# EAGLE design Öffnungsmelder (EAGLE 4.15)
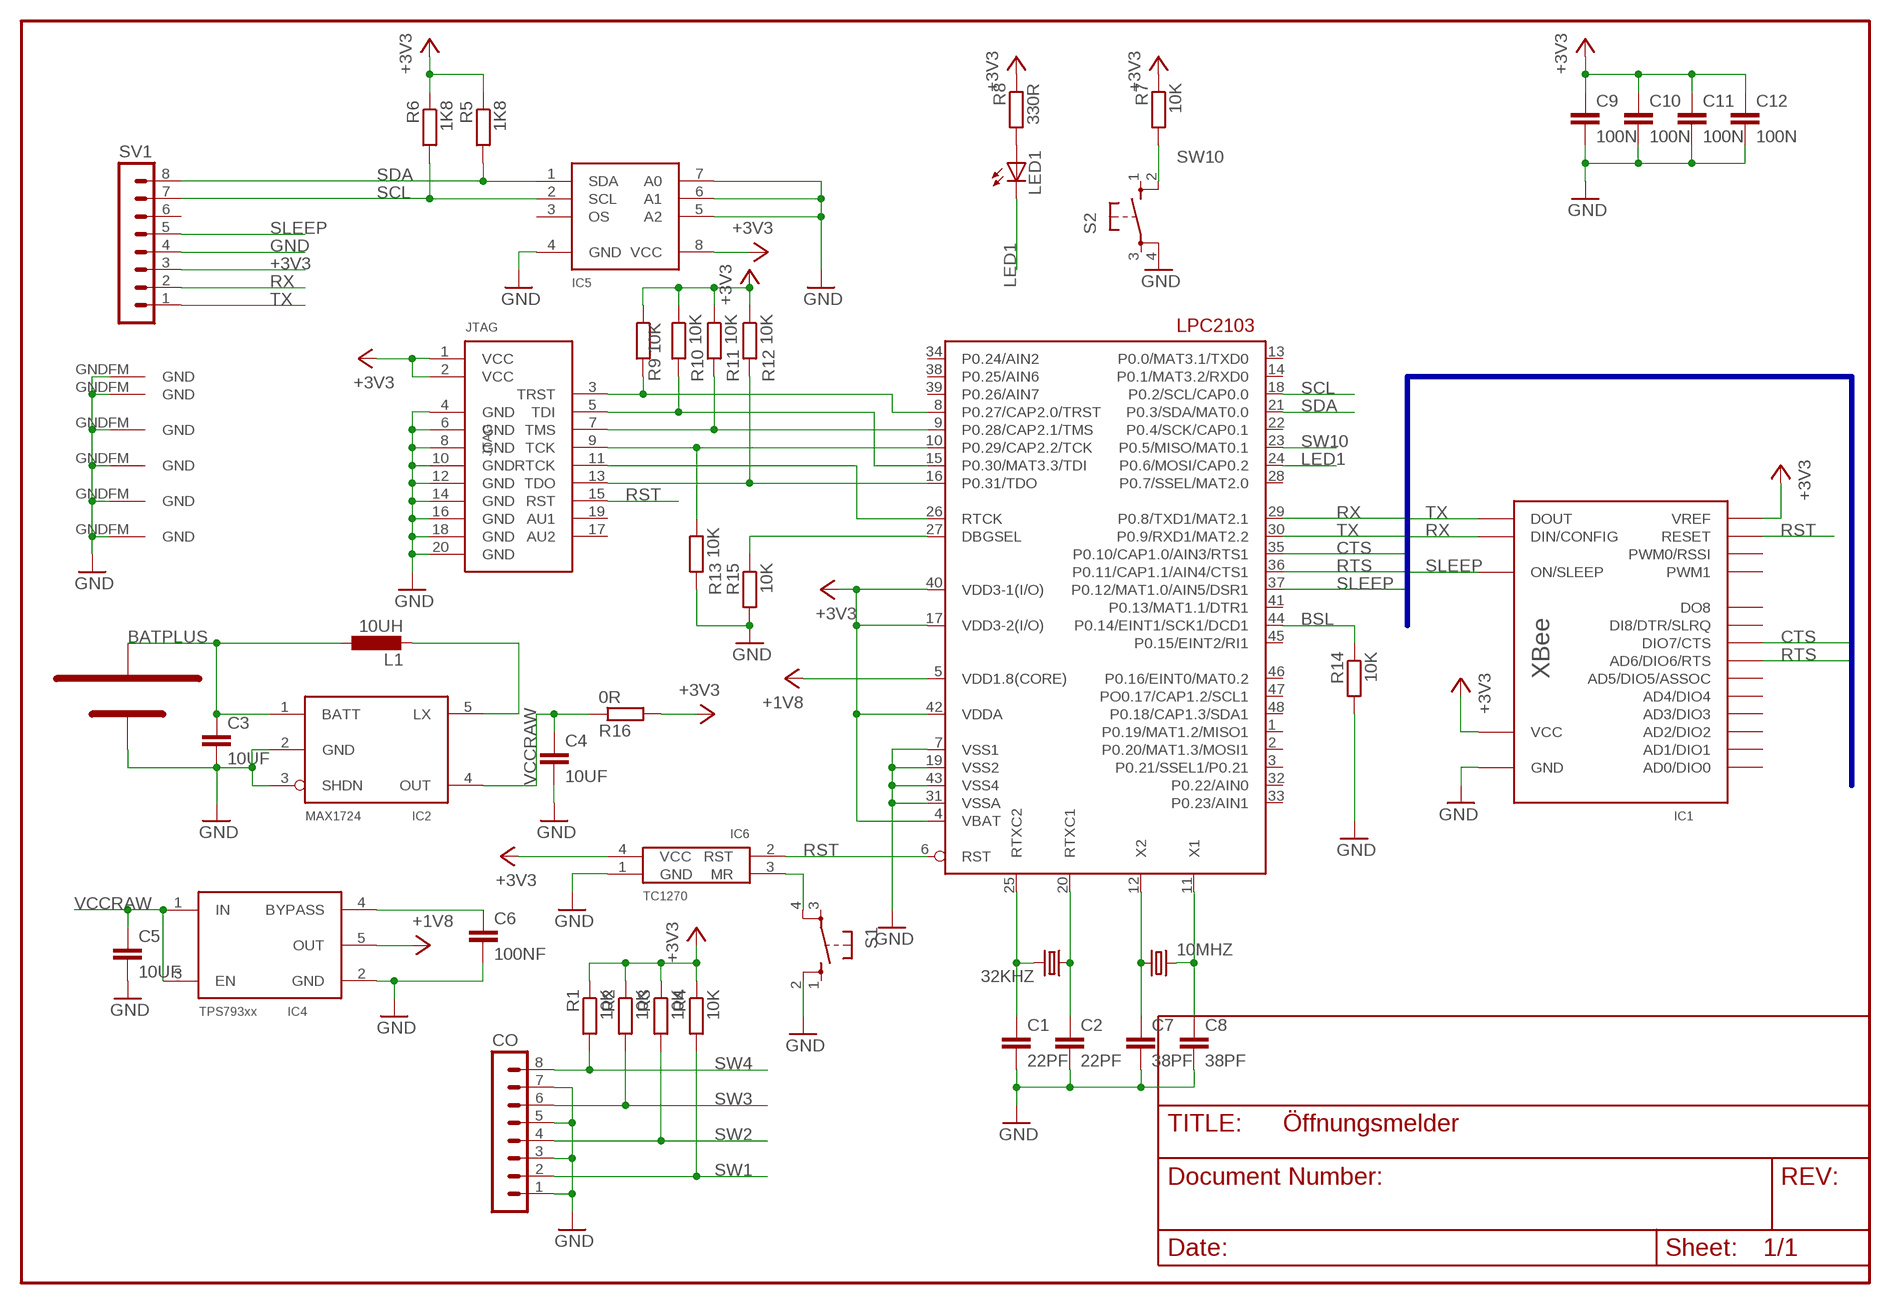
[diagram p0: schematic, sheet 1]

## Parts
10MHZ  CRYTALHC49S  [HC49/S]
32KHZ  CRYTALTC26V  [TC26V]
C1  22PF  C-EUC0805  [C0805]
C2  22PF  C-EUC0805  [C0805]
C3  10UF  C-EUC0805  [C0805]
C4  10UF  C-EUC0805  [C0805]
C5  10UF  C-EUC0805  [C0805]
C6  100NF  C-EUC0805  [C0805]
C7  38PF  C-EUC0805  [C0805]
C8  38PF  C-EUC0805  [C0805]
C9  100N  C-EUC0805  [C0805]
C10  100N  C-EUC0805  [C0805]
C11  100N  C-EUC0805  [C0805]
C12  100N  C-EUC0805  [C0805]
CO  MA08-1  [MA08-1]
GND  STITCHVIA  [STITCHVIA]
GND19  STITCHVIA  [STITCHVIA]
IC1  XBEE  [XBEE]
IC2  MAX1724  [SOT23-5L]
IC3  LPC2103  [LQFP48]
IC4  TPS793XX  [SOT23-5L]
IC5  SE95  [MSOP8]
IC6  TC1270  [SOT143R_INFINEON]
JTAG  ARM-JTAGVERTIKAL  [ML20]
L1  10UH  L-EU  [L2634MURATA]
LED1  LEDCHIP-LED0805  [CHIP-LED0805]
R1  10K  R-EU_M0805  [M0805]
R2  10K  R-EU_M0805  [M0805]
R3  10K  R-EU_M0805  [M0805]
R4  10K  R-EU_M0805  [M0805]
R5  1K8  R-EU_M0805  [M0805]
R6  1K8  R-EU_M0805  [M0805]
R7  10K  R-EU_M0805  [M0805]
R8  330R  R-EU_M0805  [M0805]
R9  10K  R-EU_M0805  [M0805]
R10  10K  R-EU_M0805  [M0805]
R11  10K  R-EU_M0805  [M0805]
R12  10K  R-EU_M0805  [M0805]
R13  10K  R-EU_M0805  [M0805]
R14  10K  R-EU_M0805  [M0805]
R15  10K  R-EU_M0805  [M0805]
R16  0R  R-EU_M0805  [M0805]
S1  10XX  [B3F-10XX]
S2  10XX  [B3F-10XX]
SV1  MA08-1  [MA08-1]
U$1  BATTERY_SINGLECELL  [BATTERYHOLDER_AA_SINGLE]
U$3  STITCHVIA  [STITCHVIA]
U$4  STITCHVIA  [STITCHVIA]
U$5  STITCHVIA  [STITCHVIA]
U$6  STITCHVIA  [STITCHVIA]

## Nets
+3V3: C9.1 C10.1 C11.1 C12.1 IC1.1(VCC) IC1.14(VREF) IC3.4(VBAT) IC3.17(VDD3-2(I/O)) IC3.40(VDD3-1(I/O)) IC3.42(VDDA) IC5.8(VCC) IC6.4(VCC) JTAG.1(VCC) JTAG.2(VCC) R1.1 R2.1 R3.1 R4.1 R5.1 R6.1 R7.1 R8.1 R9.1 R10.1 R11.1 R12.1 R16.2 SV1.3
BATPLUS: C3.1 IC2.1(BATT) L1.P$1 U$1.VCC
BSL: IC3.44(P0.14/EINT1/SCK1/DCD1) R14.1
CTS: IC1.12(DIO7/CTS) IC3.35(P0.10/CAP1.0/AIN3/RTS1)
GND: C1.2 C2.2 C3.2 C4.2 C5.2 C6.2 C7.2 C8.2 C9.2 C10.2 C11.2 C12.2 CO.1 CO.3 CO.5 CO.7 GND19.GNDFM(GND) GND.GNDFM(GND) IC1.10(GND) IC2.2(GND) IC2.3(SHDN) IC3.7(VSS1) IC3.19(VSS2) IC3.31(VSSA) IC3.43(VSS4) IC4.2(GND) IC5.4(GND) IC5.5(A2) IC5.6(A1) IC5.7(A0) IC6.1(GND) JTAG.4(GND) JTAG.6(GND) JTAG.8(GND) JTAG.10(GND) JTAG.12(GND) JTAG.14(GND) JTAG.16(GND) JTAG.18(GND) JTAG.20(GND) R13.2 R14.2 R15.2 S1.2 S2.4 SV1.4 U$1.GND U$3.GNDFM(GND) U$4.GNDFM(GND) U$5.GNDFM(GND) U$6.GNDFM(GND)
LED1: IC3.24(P0.6/MOSI/CAP0.2) LED1.C
MANRST: IC6.3(MR) S1.4
N$1: 32KHZ.2 C1.1 IC3.25(RTXC2)
N$2: 32KHZ.1 C2.1 IC3.20(RTXC1)
N$3: 10MHZ.1 C7.1 IC3.12(X2)
N$4: 10MHZ.2 C8.1 IC3.11(X1)
N$6: IC3.26(RTCK) JTAG.11(RTCK)
N$7: IC3.8(P0.27/CAP2.0/TRST) JTAG.3(TRST) R9.2
N$8: IC3.15(P0.30/MAT3.3/TDI) JTAG.5(TDI) R10.2
N$9: IC3.9(P0.28/CAP2.1/TMS) JTAG.7(TMS) R11.2
N$10: IC3.10(P0.29/CAP2.2/TCK) JTAG.9(TCK) R13.1
N$14: LED1.A R8.2
N$15: IC2.5(LX) L1.P$2
N$16: IC3.27(DBGSEL) R15.1
N$17: C6.1 IC4.4(BYPASS)
N$19: IC3.16(P0.31/TDO) JTAG.13(TDO) R12.2
RST: IC1.5(RESET) IC3.6(RST) IC6.2(RST) JTAG.15(RST)
RTS: IC1.16(AD6/DIO6/RTS) IC3.36(P0.11/CAP1.1/AIN4/CTS1)
RX: IC1.3(DIN/CONFIG) IC3.29(P0.8/TXD1/MAT2.1) SV1.2
SCL: IC3.18(P0.2/SCL/CAP0.0) IC5.2(SCL) R6.2 SV1.7
SDA: IC3.21(P0.3/SDA/MAT0.0) IC5.1(SDA) R5.2 SV1.8
SLEEP: IC1.13(ON/SLEEP) IC3.37(P0.12/MAT1.0/AIN5/DSR1) SV1.5
SW1: CO.2 R4.2
SW2: CO.4 R3.2
SW3: CO.6 R2.2
SW4: CO.8 R1.2
SW10: IC3.23(P0.5/MISO/MAT0.1) R7.2 S2.2
TX: IC1.2(DOUT) IC3.30(P0.9/RXD1/MAT2.2) SV1.1
VCCINT: IC3.5(VDD1.8(CORE)) IC4.5(OUT) ; supply symbol labelled +1V8
VCCRAW: C4.1 C5.1 IC2.4(OUT) IC4.1(IN) IC4.3(EN) R16.1
Unconnected: IC1.4(DO8) IC1.6(PWM0/RSSI) IC1.7(PWM1) IC1.9(DI8/DTR/SLRQ) IC1.11(AD4/DIO4) IC1.15(AD5/DIO5/ASSOC) IC1.17(AD3/DIO3) IC1.18(AD2/DIO2) IC1.19(AD1/DIO1) IC1.20(AD0/DIO0) IC3.1(P0.19/MAT1.2/MISO1) IC3.2(P0.20/MAT1.3/MOSI1) IC3.3(P0.21/SSEL1/P0.21) IC3.13(P0.0/MAT3.1/TXD0) IC3.14(P0.1/MAT3.2/RXD0) IC3.22(P0.4/SCK/CAP0.1) IC3.28(P0.7/SSEL/MAT2.0) IC3.32(P0.22/AIN0) IC3.33(P0.23/AIN1) IC3.34(P0.24/AIN2) IC3.38(P0.25/AIN6) IC3.39(P0.26/AIN7) IC3.41(P0.13/MAT1.1/DTR1) IC3.45(P0.15/EINT2/RI1) IC3.46(P0.16/EINT0/MAT0.2) IC3.47(PO0.17/CAP1.2/SCL1) IC3.48(P0.18/CAP1.3/SDA1) IC5.3(OS) JTAG.17(AU2) JTAG.19(AU1) S1.1 S1.3 S2.1 S2.3 SV1.6

## Buses
SLEEP,RX,TX,CTS,RTS

## Library data of the parts
10MHZ 32KHZ = turbod3:CRYTAL: CRYSTAL
C1-C12 = turbod3:C-EU: CAPACITOR, European symbol
CO SV1 = con-lstb:MA08-1: PIN HEADER
GND GND19 U$3-U$6 = turbod3:STITCHVIA
IC1 = turbod3:XBEE
IC2 = turbod3:MAX1724
IC3 = turbod3:LPC2103: LPC2101/2102/2103 microcontroler from Philips
IC4 = turbod3:TPS793XX
IC5 = turbod3:SE95
IC6 = turbod3:TC1270
JTAG = turbod3:ARM-JTAG
L1 = turbod3:L-EU: INDUCTOR, European symbol
LED1 = led:LED: LED OSRAM: - CHIPLED LG R971, LG N971, LY N971, LG Q971, LY Q971, LO R971, LY R971 LH N974, LH R974 LS Q976, LO Q976, LY Q976 LO Q996 - Hyper CHIPLED LW Q18S LB Q993, LB Q99A, LB R99A - SideLED LS A670, LO A670, LY A670, LG A670, LP A670 LB A673, LV A673, LT A673, LW A673 LH A674 LY A675 LS A676, LA A676, LO A676, LY A676, LW A676 LS A679, LY A679, LG A679 - Hyper Micro SIDELED® LS Y876, LA Y876, LO Y876, LY Y876 LT Y87S - SmartLED LW L88C, LW L88S LB L89C, LB L89S, LG L890 LS L89K, LO L89K, LY L89K LS L896, LA L896, LO L896, LY L896 - TOPLED LS T670, LO T670, LY T670, LG T670, LP T670 LSG T670, LSP T670, LSY T670, LOP T670, LYG T670 LG T671, LOG T671, LSG T671 LB T673, LV T673, LT T673, LW T673 LH T674 LS T676, LA T676, LO T676, LY T676, LB T676, LH T676, LSB T676, LW T676 LB T67C, LV T67C, LT T67C, LS T67K, LO T67K, LY T67K, LW E67C LS E67B, LA E67B, LO E67B, LY E67B, LB E67C, LV E67C, LT E67C LW T67C LS T679, LY T679, LG T679 LS T770, LO T770, LY T770, LG T770, LP T770 LB T773, LV T773, LT T773, LW T773 LH T774 LS E675, LA E675, LY E675, LS T675 LS T776, LA T776, LO T776, LY T776, LB T776 LHGB T686 LT T68C, LB T68C - Hyper Mini TOPLED® LB M676 - Mini TOPLED Santana® LG M470 LS M47K, LO M47K, LY M47K Source: http://www.osram.convergy.de/
R1-R16 = turbod3:R-EU_: RESISTOR, European symbol
S1 S2 = KEY_B:10XX
U$1 = turbod3:BATTERY_SINGLECELL

## Board
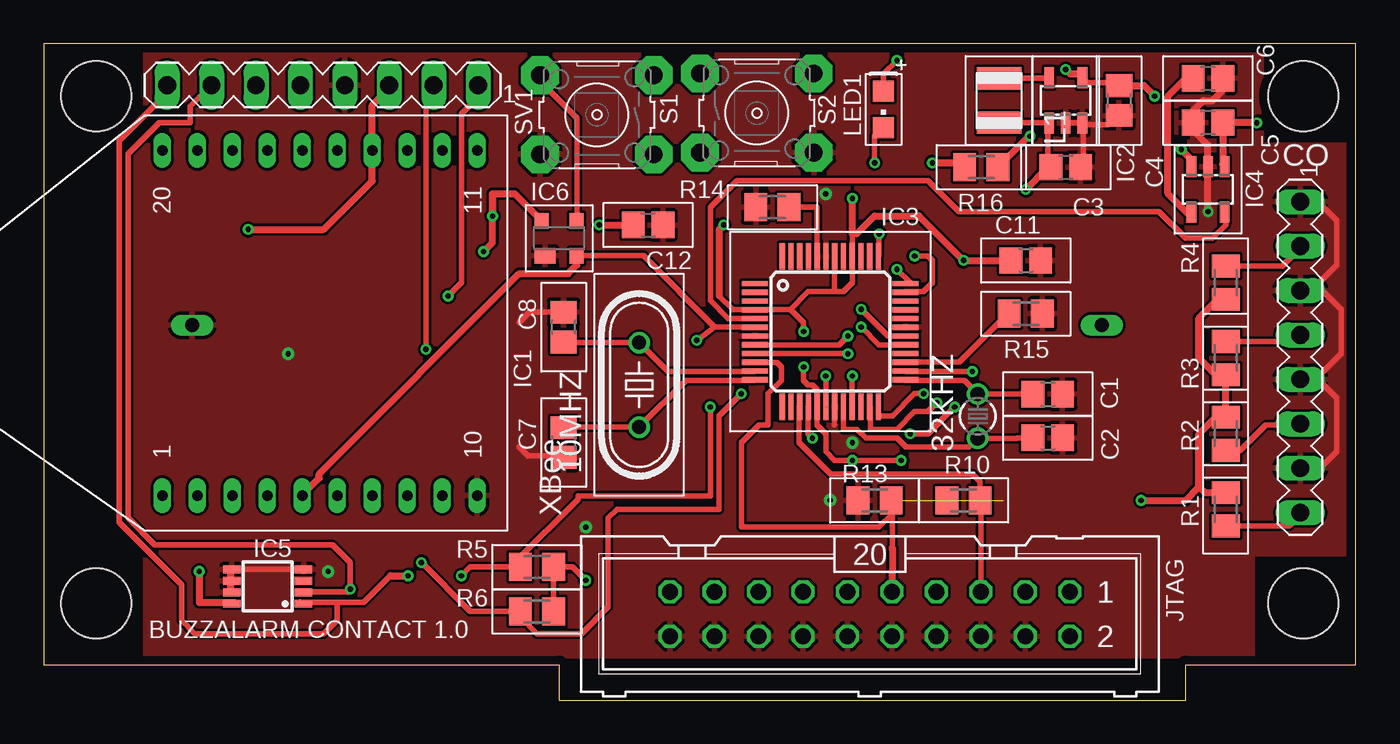
[diagram p1: board, top side]
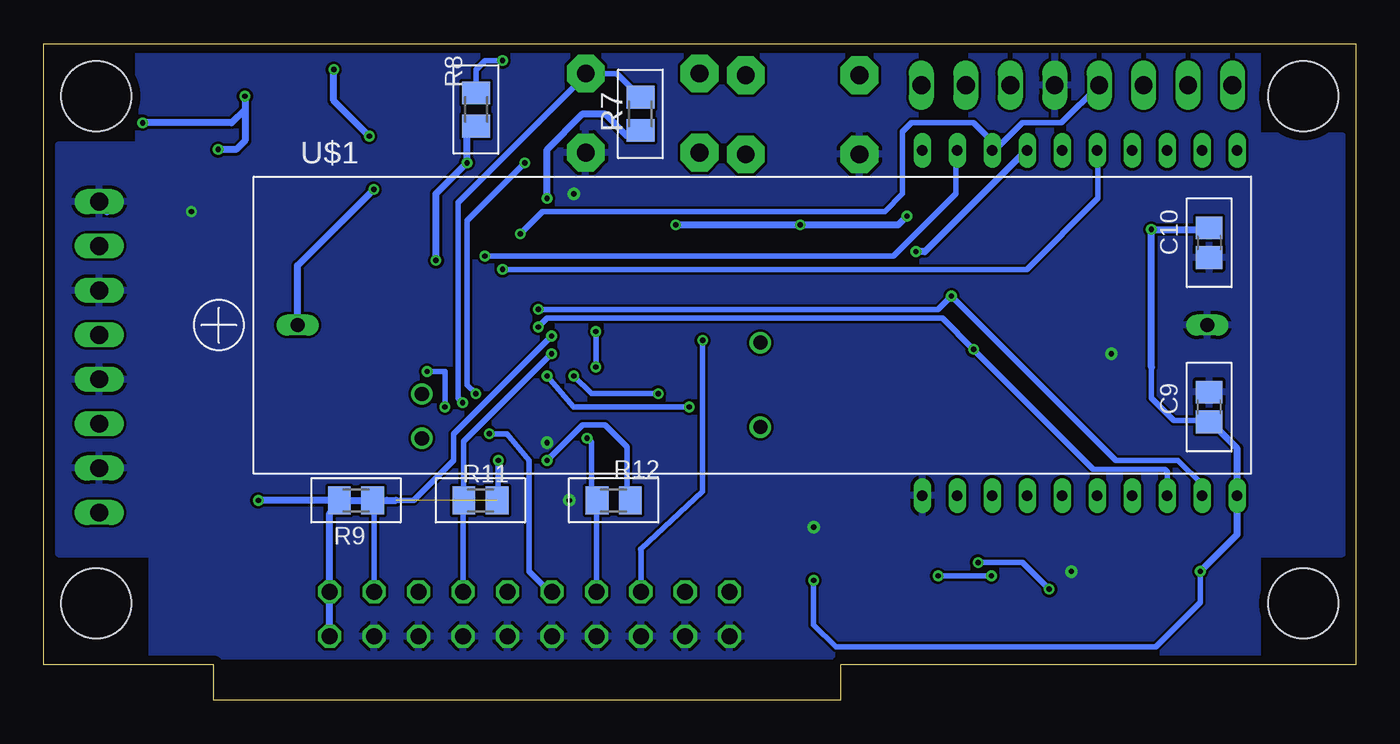
[diagram p2: board, bottom side, seen from below]

Size 75 x 37.54 mm. Coordinates in mm from the lower left corner, seen from the top.
Outline: 0,2.03 29.46,2.03 29.46,0 65.28,0 65.28,2.03 75,2.03 75,37.54 0,37.54 0,2.03
Copper layers (1*16): Top 0.035mm / dielectric 1.5mm / Bottom 0.035mm
Design rules "PCB-POOL": minimum track width 6mil, minimum drill 12mil, track to track 6mil, track to pad 6mil, pad to pad 6mil, via to via 6mil, smd to smd 6mil, copper to edge 20mil, drill to drill 8mil, minimum pad ring 8mil, minimum via ring 6mil, stop-mask expansion 3mil, vias tented up to drill 0mil, thermal gap 8mil
Holes 4 mm at 3,34.54 3,5.54 72,34.54 72,5.54

### Footprints (pad centres in the part's own frame; a part is rotated, then mirrored left to right if it is on the bottom)
HC49/S = drill 0.813 round: 1 -2.413,0; 2 2.413,0
TC26V = drill 0.813 round: 1 -1.27,0; 2 1.27,0
C0805 = smd 1.3 x 1.5: 1 -0.85,0; 2 0.85,0
MA08-1 = drill 1.016 long: 1 -8.89,0; 2 -6.35,0; 3 -3.81,0; 4 -1.27,0; 5 1.27,0; 6 3.81,0; 7 6.35,0; 8 8.89,0
STITCHVIA = drill 0.305 pad 0.61 round: GNDFM 0,0
XBEE = drill 0.6 long: 1 -9.73,17; 2 -9.73,15; 3 -9.73,13; 4 -9.73,11; 5 -9.73,9; 6 -9.73,7; 7 -9.73,5; 8 -9.73,3; 9 -9.73,1; 10 -9.73,-1; 11 10,-1; 12 10,1; 13 10,3; 14 10,5; 15 10,7; 16 10,9; 17 10,11; 18 10,13; 19 10,15; 20 10,17
SOT23-5L = smd 0.55 x 1.2: 1 -0.95,-1.3; 2 0,-1.3; 3 0.95,-1.3; 4 0.95,1.3; 5 -0.95,1.3
LQFP48 = smd 1.5 x 0.3: 1 -4.3,2.75; 2 -4.3,2.25; 3 -4.3,1.75; 4 -4.3,1.25; 5 -4.3,0.75; 6 -4.3,0.25; 7 -4.3,-0.25; 8 -4.3,-0.75; 9 -4.3,-1.25; 10 -4.3,-1.75; 11 -4.3,-2.25; 12 -4.3,-2.75; 25 4.3,-2.75; 26 4.3,-2.25; 27 4.3,-1.75; 28 4.3,-1.25; 29 4.3,-0.75; 30 4.3,-0.25; 31 4.3,0.25; 32 4.3,0.75; 33 4.3,1.25; 34 4.3,1.75; 35 4.3,2.25; 36 4.3,2.75 | smd 0.3 x 1.5: 13 -2.75,-4.3; 14 -2.25,-4.3; 15 -1.75,-4.3; 16 -1.25,-4.3; 17 -0.75,-4.3; 18 -0.25,-4.3; 19 0.25,-4.3; 20 0.75,-4.3; 21 1.25,-4.3; 22 1.75,-4.3; 23 2.25,-4.3; 24 2.75,-4.3; 37 2.75,4.3; 38 2.25,4.3; 39 1.75,4.3; 40 1.25,4.3; 41 0.75,4.3; 42 0.25,4.3; 43 -0.25,4.3; 44 -0.75,4.3; 45 -1.25,4.3; 46 -1.75,4.3; 47 -2.25,4.3; 48 -2.75,4.3
MSOP8 = smd 0.45 x 1: 1 -0.975,-2.05; 2 -0.325,-2.05; 3 0.325,-2.05; 4 0.975,-2.05; 5 0.975,2.05; 6 0.325,2.05; 7 -0.325,2.05; 8 -0.975,2.05
SOT143R_INFINEON = smd 1.2 x 0.9: 1 -0.8,-1 | smd 0.8 x 0.9: 2 1,-1; 3 1,1; 4 -1,1
ML20 = drill 0.914 octagon: 1 -11.43,-1.27; 2 -11.43,1.27; 3 -8.89,-1.27; 4 -8.89,1.27; 5 -6.35,-1.27; 6 -6.35,1.27; 7 -3.81,-1.27; 8 -3.81,1.27; 9 -1.27,-1.27; 10 -1.27,1.27; 11 1.27,-1.27; 12 1.27,1.27; 13 3.81,-1.27; 14 3.81,1.27; 15 6.35,-1.27; 16 6.35,1.27; 17 8.89,-1.27; 18 8.89,1.27; 19 11.43,-1.27; 20 11.43,1.27
L2634MURATA = smd 1.27 x 2.54: P$1 -1.27,0; P$2 1.27,0
CHIP-LED0805 = smd 1.2 x 1.2: A 0,-1.05; C 0,1.05
M0805 = smd 1.3 x 1.6: 1 -0.95,0; 2 0.95,0
B3F-10XX = drill 1.016 pad 2.159 octagon: 1 -3.379,2.312; 2 3.123,2.312; 3 -3.379,-2.209; 4 3.123,-2.209
BATTERYHOLDER_AA_SINGLE = drill 0.8 pad 1 long: GND -26.5,0.5; VCC 25.5,0.5

### Placement (x,y rotation side)
10MHZ  34.04,18.03 90 top
32KHZ  53.39,16.24 90 top
C1  57.39,17.5 0 top
C2  57.39,15.01 0 top
C3  58.42,30.48 0 top
C4  61.47,34.29 270 top
C5  66.55,33.02 180 top
C6  66.55,35.56 0 top
C7  29.72,14.73 270 top
C8  29.72,21.34 90 top
C9  8.38,16.76 90 bottom
C10  8.38,26.16 270 bottom
C11  56.13,25.15 0 top
C12  34.54,27.18 0 top
CO  71.83,19.62 270 top
GND  44.96,11.43 0 top
GND19  46.23,14.73 0 top
IC1  23.77,21.44 90 top
IC2  58.42,34.29 0 top
IC3  44.96,21.08 0 top
IC4  66.55,29.21 180 top
IC5  12.8,6.5 90 top
IC6  29.46,26.42 0 top
JTAG  47.22,4.93 180 top
L1  54.61,34.29 90 top
LED1  48.01,33.78 180 top
R1  67.56,10.92 270 top
R2  67.56,15.24 270 top
R3  67.56,19.56 90 top
R4  67.56,23.88 90 top
R5  28.19,7.62 180 top
R6  28.19,5.08 180 top
R7  40.89,33.53 90 bottom
R8  50.29,33.78 90 bottom
R9  57.15,11.43 0 bottom
R10  52.58,11.43 0 top
R11  50.04,11.43 180 bottom
R12  42.42,11.43 180 bottom
R13  47.5,11.43 180 top
R14  41.66,28.19 180 top
R15  56.13,22.1 0 top
R16  53.59,30.48 180 top
S1  31.5,33.53 180 top
S2  40.89,33.53 0 top
SV1  15.94,35.17 180 top
U$1  34.99,21.95 180 bottom
U$3  13.97,19.81 0 top
U$4  44.7,28.96 0 top
U$5  30.99,9.91 0 top
U$6  16.26,7.37 0 top

### Tracks (layer width: path | path; a pad name or v marks a point on that pad's centre or on a via)
+3V3  (via drill 0.3)  (2 unrouted)
  Top 0.305: 42.67,22.35 43.69,23.37 45.21,23.37 | IC3.42 45.21,25.4 | IC3.42 | IC3.42 | 45.21,23.37 IC3.42 | 45.21,23.37 45.72,23.37 46.23,23.88 46.23,25.4 | IC3.40 46.23,25.4 | 42.67,22.35 40.68,22.35 IC3.4 39.39,22.33 38.61,23.11 | 42.67,22.35 43.43,21.59 v43.43,21.08 | 44.2,16.79 IC3.17 44.2,16.77 | v43.43,19.05 43.43,18.29 43.69,18.03 43.94,18.03 44.2,17.78 44.2,16.77 | 44.2,16.77 44.2,16.76 | 44.2,16.77 44.2,15.75 44.7,15.24 44.7,14.22 45.21,13.72 v46.23,13.72 v49.02,13.72 | 46.23,25.4 46.23,26.67 46.48,26.67 | R6.1 29.21,5.33 29.14,5.4 R5.1 30.23,7.62 v30.99,6.86
  Top 0.406: R4.1 67.12,22.93 66.04,21.84 66.04,19.56 67.31,18.29 67.56,18.54 R3.1 R2.1 67.56,16.26 67.31,16.51 66.04,15.24 66.04,12.19 | R1.1 66.36,11.87 66.04,12.19 | 46.48,26.67 47.5,27.69 50.04,27.69 v52.58,25.15 C11.1 55.37,25.15 | v62.74,11.43 65.28,11.43 66.04,12.19 | R16.2 52.58,30.48 52.32,30.73 v50.8,30.73 | 46.23,26.67 v46.23,28.7 | 38.61,23.11 38.61,26.92 v38.86,27.18 | 25.65,28.96 v25.65,27.69 | 25.65,28.96 26.92,28.96 IC6.4 | v31.75,27.18 C12.1 | SV1.3 19.75,35.11 19.81,35.05 18.77,34.01 18.77,31.47 | 18.77,31.47 IC1.14 | 25.65,28.96 25.65,26.16 v25.15,25.65 | 18.77,31.47 18.77,29.7 16,26.92 v11.68,26.92 | v8.89,7.37 8.89,5.59 10.92,5.59 10.86,5.53 IC5.8
  Bottom 0.305: v43.43,21.08 v43.43,19.05 | v46.23,13.72 44.2,15.75 42.93,15.75 41.66,14.48 41.66,11.43 R12.1 | R11.1 49.02,11.43 v49.02,13.72 | v30.99,6.86 30.99,4.32 29.72,3.05 11.43,3.05 8.89,5.59 v8.89,7.37 | 11.68,19.05 11.68,17.27 10.41,16 8.38,16
  Bottom 0.406: JTAG.2 58.65,6.07 58.67,6.1 58.65,6.12 JTAG.1 58.65,10.69 57.91,11.43 | 57.91,11.43 R9.1 v62.74,11.43 | v52.58,25.15 52.58,28.96 v50.8,30.73 50.8,32.51 50.29,33.02 R8.1 | v46.23,28.7 46.23,31.5 44.2,33.53 42.93,33.53 41.66,32.26 41.15,32.26 40.89,32.51 R7.1 | v25.65,27.69 26.16,27.18 v31.75,27.18 v38.86,27.18 | IC1.14 18.77,31.47 18.8,31.5 24.64,25.65 v25.15,25.65 | C10.1 8.38,26.92 v11.68,26.92 11.68,19.05 | 8.55,15.91 C9.1 8.38,16 6.77,14.39 IC1.1 6.77,9.48 v8.89,7.37 | 57.91,11.43 55.37,11.43 54.86,11.43
BATPLUS  (via drill 0.3)
  Top 0.305: L1.P$1 57.44,33.02 IC2.1 57.4,32.92 57.4,30.48
  Top 0.406: C3.1 57.4,30.48 v56.13,29.21
  Bottom 0.406: U$1.VCC 60.49,24.86 v56.13,29.21
BSL
  Top 0.305: IC3.44 44.2,25.39 44.2,28.19 R14.1
CTS  (via drill 0.3)
  Top 0.305: v49.78,25.4 50.55,25.4 50.8,25.15 50.8,23.88 50.29,23.37 49.28,23.37 49.28,23.35 IC3.35
  Bottom 0.305: IC1.12 22.86,31.35 22.86,28.96 26.42,25.4 v49.78,25.4
GND  (via drill 0.3)
  Top 0.305: C3.2 59.44,30.48 59.44,32.92 | 59.44,32.92 IC2.3 59.34,33.02 58.42,33.02 IC2.2 | IC5.5 14.94,7.48 | C8.2 27.77,22.19 27.18,21.59 | 27.18,14.48 27.69,13.97 29.72,13.97 C7.2 | CO.7 72.96,13.27 73.91,14.22 73.91,17.27 72.77,18.41 | 72.77,18.41 72.39,18.8 71.88,18.29 CO.5 | 72.39,23.43 73.09,23.43 74.17,22.35 74.17,19.81 72.77,18.41 | 72.39,23.43 CO.3 | 72.77,18.41 72.64,18.29 | CO.1 72.84,28.51 73.91,27.43 73.91,24.89 72.39,23.37 72.39,23.43 | C4.2 61.47,33.53 60.86,32.92 59.44,32.92 | IC3.19 45.21,15.75
  Top 0.406: 10.67,6.83 10.67,6.81 | IC5.5 10.67,7.48 10.67,6.83 | IC5.7 10.67,6.18 10.67,6.83 | 10.67,6.83 IC5.6 | C6.2 67.4,34.89 66.8,34.29 66.29,34.29 65.53,33.53 65.53,33.02 C5.2 65.7,32.6 66.55,31.75 IC4.2 | IC4.2 66.55,30.48 | v66.55,27.94 IC4.2 | IC5.4 14.88,7.48 14.94,7.42 14.94,7.48 IC5.4
  Bottom 0.406: CO.1 71.88,28.45 71.37,27.94
  pour Top: 0.51,31.75 5.84,31.75 5.84,37.08 69.6,37.08 69.6,31.75 74.68,31.75 74.93,8.38 69.09,8.38 69.09,2.54 5.84,2.54 5.84,8.38 0.51,8.38
  pour Bottom: 0.76,8.38 0.76,32.26 5.59,32.26 5.59,37.08 69.6,37.08 69.6,32 69.6,31.75 74.17,31.75 74.17,8.38 68.83,8.38 68.83,2.54 5.59,2.54 5.59,8.38 6.35,8.38
LED1  (via drill 0.3)
  Top 0.305: IC3.24 47.73,16.26 48.51,16.26 49.78,17.53 v50.29,17.53 | LED1.C 48.01,32.77 47.5,32.26 v47.5,30.73
  Bottom 0.305: v50.29,17.53 50.8,18.03 50.8,27.43 v47.5,30.73
MANRST
  Top 0.305: IC6.3 30.48,27.43 30.48,33.27 28.45,35.31 28.45,35.81 | 28.45,35.81 | 28.45,35.81 S1.4
N$1
  Top 0.305: IC3.25 49.28,18.31 49.28,18.29 52.62,18.29 32KHZ.2 55.87,17.51 | 55.87,17.51 55.85,17.5 C1.1 | 55.87,17.51 55.88,17.53
N$2
  Top 0.305: IC3.20 45.72,15.49 46.48,15.49 46.99,14.99 48.77,14.99 49.28,14.48 52.9,14.48 32KHZ.1 55.61,14.97 55.65,15.01 C2.1
N$3
  Top 0.305: IC3.12 40.64,18.31 40.64,18.29 36.7,18.29 10MHZ.1 29.84,15.62 29.72,15.75 C7.1
N$4
  Top 0.305: IC3.11 40.64,18.81 40.64,18.8 35.69,18.8 10MHZ.2 29.59,20.45 29.55,20.49 | 29.55,20.49 29.46,20.57 | C8.1 29.55,20.49
N$6  (via drill 0.3)
  Top 0.305: 49.53,18.8 49.49,18.83 IC3.26 49.28,18.81 49.28,18.8 v53.09,18.8 | v49.53,15.24 50.55,15.24 v52.07,16.76
  Bottom 0.305: v49.53,15.24 48.51,15.24 47.24,13.72 47.24,7.37 45.97,6.1 45.95,6.12 JTAG.11 | v52.07,16.76 52.07,18.8 v53.09,18.8
N$7  (via drill 0.3)
  Top 0.305: v45.97,20.83 45.47,20.32 40.64,20.32 IC3.8
  Bottom 0.305: 56.13,11.43 R9.2 | JTAG.3 56.11,11.41 56.13,11.43 | 56.13,11.43 53.85,11.43 51.56,13.72 51.56,15.24 v45.97,20.83
N$8
  Top 0.305: JTAG.5 53.57,11.41 53.59,11.43 R10.2 53.53,12.51 53.09,12.95 44.96,12.95 43.18,14.73 43.18,16.76 43.2,16.78 IC3.15
N$9  (via drill 0.3)
  Top 0.305: IC3.9 40.64,19.81 v45.97,19.81
  Bottom 0.305: JTAG.7 51.03,11.41 51.05,11.43 R11.2 50.99,14.8 v45.97,19.81
N$10
  Top 0.305: 48.51,11.43 48.49,11.41 | IC3.10 40.64,19.31 40.64,19.3 41.91,19.3 42.16,19.05 42.16,18.29 41.4,17.53 41.4,15.75 40.89,15.75 39.88,14.73 39.88,12.45 39.88,9.91 47.75,9.91 48.51,10.67 | 48.51,11.38 48.51,8.72
  Top 0.406: R13.1 48.51,11.43 48.51,10.67 | 48.51,8.64 48.51,8.72 JTAG.9 | 48.49,11.41 48.51,11.38
N$14  (via drill 0.3)
  Top 0.305: LED1.A 48.01,35.81 v48.77,36.58
  Bottom 0.305: v48.77,36.58 49.78,36.58 50.29,36.07 R8.2
N$15
  Top 0.305: 57.4,35.66 IC2.5 | 57.4,35.66 57.4,35.81 | 57.4,35.66 57.4,35.56 L1.P$2
N$16
  Top 0.305: R15.1 55.12,22.1 52.35,19.33 IC3.27
N$17
  Top 0.406: C6.1 65.28,35.56 64.26,34.54 64.26,28.96 65.53,27.69 65.6,27.75 IC4.4
N$19  (via drill 0.3)
  Top 0.305: 43.69,16.51 43.71,16.53 IC3.16 43.69,16.76 43.69,15.24 v43.94,14.99
  Bottom 0.305: JTAG.13 43.41,11.41 43.43,11.43 R12.2 43.37,11.62 43.69,11.94 43.69,14.73 v43.94,14.99
RST  (via drill 0.3)
  Top 0.305: 38.35,21.33 IC3.6 | 38.35,21.33 v37.34,20.57 | 38.35,21.33 38.35,21.34 34.27,25.42 IC6.2
  Top 0.406: IC6.2 30.46,24.88 29.97,24.38 27.18,24.38 15.75,12.95 15.75,12.7 14.76,11.71 | 14.76,11.71 14.73,11.68 | IC1.5 14.76,11.71
  Bottom 0.305: 40.87,8.66 40.89,8.64 | 40.87,8.66 JTAG.15 | v37.34,20.57 37.34,11.94 40.87,8.66
RTS  (via drill 0.3)
  Top 0.305: IC3.36 49.3,23.88 49.53,23.88 v48.77,24.64
  Bottom 0.305: IC1.16 14.73,31.39 14.73,28.7 18.8,24.64 v48.77,24.64
RX  (via drill 0.3)
  Top 0.305: 22.29,35.24 22.35,35.31 | 22.29,35.24 SV1.2 | v21.84,20.07 21.84,34.8 22.29,35.24 | IC3.29 49.28,20.32 | IC3.29 | v46.74,21.34 47.75,20.32 IC3.29
  Bottom 0.305: IC1.3 10.77,13.06 10.92,13.21 14.99,13.21 v21.84,20.07 23.62,21.84 46.23,21.84 v46.74,21.34
SCL  (via drill 0.3)  (1 unrouted)
  Top 0.305: v21.59,7.87 24.38,5.08 R6.2 | 17.37,6.2 14.83,6.2 | 27.24,4.76 28.19,3.81 30.73,3.81 32.26,5.33 32.26,10.41 32.77,10.92 38.61,10.92 38.61,16.26 v39.88,17.53 | 44.71,16.77 v44.71,18.54 v44.7,18.54 | SV1.7 8.38,33.96 8.38,33.02 6.6,33.02 4.83,31.24 4.83,10.41 6.35,8.89 16.51,8.89 17.53,7.87 v17.53,6.35
  Top 0.406: 14.87,6.2 IC5.2 14.83,6.2 14.63,6.2 | v17.53,6.35 17.37,6.2 | R6.2 27.24,4.76
  Bottom 0.305: v21.59,7.87 19.05,7.87 v17.53,6.35 | v39.88,17.53 43.69,17.53 v44.7,18.54
SDA  (via drill 0.3)
  Top 0.305: v23.88,7.11 24.38,7.62 R5.2 27.18,7.62 26.92,7.87 30.55,11.5 30.55,11.68 38.1,11.68 v38.1,16.76 | 19.81,7.11 18.29,5.59 16.76,5.59 | 16.76,5.59 14.63,5.59 | IC3.21 46.21,18.52 | SV1.8 7.05,34.74 4.32,32 4.32,10.16 7.87,6.6 7.87,4.57 8.64,3.81 16,3.81 16.76,4.57 16.76,5.59
  Top 0.406: 19.81,7.11 v20.83,7.11 | R5.2 27.43,7.62 | 14.63,5.59 14.69,5.53 IC5.1 | v46.23,18.54 46.21,18.52
  Bottom 0.305: v20.83,7.11 v23.88,7.11 | v38.1,16.76 44.7,16.76 v46.23,18.54
SLEEP  (via drill 0.3)
  Top 0.305: IC3.37 47.75,25.43 v47.75,26.67
  Bottom 0.305: SV1.5 16.82,33.02 19.05,33.02 20.83,31.24 | 20.97,31.24 21.08,31.24 | 20.97,31.24 IC1.13 20.83,31.38 20.83,31.24 | 20.83,31.24 20.97,31.24 | v47.75,26.67 46.48,27.94 26.92,27.94 25.91,28.96 25.91,32.51 25.4,33.02 21.84,33.02 20.83,32 20.83,31.24
SW1
  Top 0.305: CO.2 71.88,25.91 70.8,24.83 R4.2
SW2
  Top 0.305: CO.4 71.88,20.83 71.56,20.51 R3.2
SW3
  Top 0.305: R2.2 68.39,14.29 69.85,15.75 71.88,15.75 CO.6
SW4
  Top 0.305: CO.8 71.88,10.67 71.19,9.97 R1.2
SW10  (via drill 0.3)
  Top 0.305: IC3.23 47.24,16.75 47.24,15.49 48.77,15.49 49.78,16.51 50.55,16.51 v51.05,17.02
  Bottom 0.305: R7.2 42.23,35.81 43.99,35.81 S2.2 44.02,35.74 51.31,28.45 51.31,17.27 v51.05,17.02
TX  (via drill 0.3)
  Top 0.305: SV1.1 24.89,35.11 24.89,34.54 23.88,33.53 23.88,23.88 v23.11,23.11 | 49.28,20.83 49.53,20.83 | 49.28,20.83 IC3.30 | v46.74,22.35 48.26,20.83 49.28,20.83
  Bottom 0.305: IC1.2 8.77,12.33 10.16,13.72 13.72,13.72 v23.11,23.11 23.88,22.35 v46.74,22.35 | 24.89,35.31 24.83,35.24 SV1.1
VCCINT
  Top 0.305: IC3.5 39.13,21.83 38.1,22.86 38.1,28.19 39.62,29.72 50.55,29.72 52.32,27.94 63.75,27.94 65.28,26.42 66.8,26.42 67.56,27.18 67.56,27.98 | 67.56,27.98 67.56,28.19 | 67.56,27.98 IC4.5
VCCRAW  (via drill 0.3)
  Top 0.305: C4.1 61.47,35.31 59.65,35.31 IC2.4
  Top 0.406: R16.1 56.32,32.26 v56.39,32.26 | IC2.4 59.44,35.66 59.44,35.81 58.67,35.81 v58.42,36.07 | C4.1 62.9,35.14 v63.5,34.54 | C5.1 67.31,33.02 | v69.34,33.02 C5.1 | 67.53,30.51 67.56,30.48 | 67.53,30.51 IC4.1 | C5.1 67.4,30.65 67.53,30.51 | IC4.3 65.6,30.92 v65.02,31.5
  Bottom 0.406: v56.39,32.26 58.42,34.29 v58.42,36.07 | v69.34,33.02 64.26,33.02 63.5,33.78 v63.5,34.54 63.5,32 64.01,31.5 v65.02,31.5

### Text on the board
tNames: BUZZALARM CONTACT 1.0